# Altium schematic sheet BS5T2MBoard.SchDoc
size A
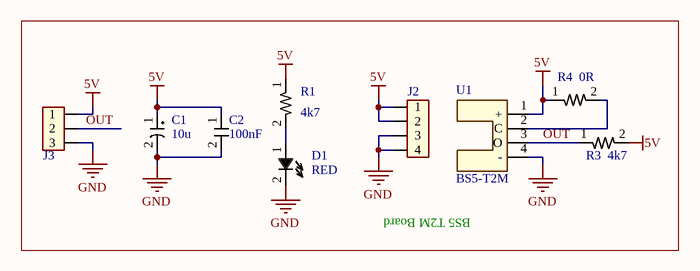
[diagram p0: BS5T2MBoard.SchDoc]

## Parts
C1  value 10u  [Tantalum Size A]  (hidden comment: Cap Pol)
C2  value 100nF  [C0805]  (hidden comment: Cap Non Pol)
D1  value RED  [D0805]  (hidden comment: LED)
J2  Header 1x4  [Header 1x4 Oval]  (value not drawn)
J3  Header 1x3  [Header 1x3 Oval]  (value not drawn)
R1  value 4k7  [R0805]  (hidden comment: Resistor)
R3  value 4k7  [R0805]  (hidden comment: Resistor)
R4  value 0R  [R0805]  (hidden comment: Resistor)
U1  BS5-T2M  [BS5-T2M]

## Blocks framed on the sheet
BS5 T2M Board: C1 C2 D1 J2 J3 R1 R3 R4 U1

## Nets
5V: C1.1 C2.1 J2.1 J2.2 J3.1 R1.1 R3.2 R4.1 U1.1(+)
GND: C1.2 C2.2 D1.2 J2.3 J2.4 J3.3 U1.4(-)
OUT: J3.2 R3.1 U1.3(O)
NetD1_1: D1.1 R1.2
NetR4_2: R4.2 U1.2(C)

## Library data of the parts
C1 = Cap Pol: Polarised Capacitor; Link: *
C2 = Cap Non Pol: Non Polarised Capacitor; Link: *
J2 = Header 1x4: 2.54mm Single Male/Female Pin Header; Link: *
J3 = Header 1x3: 2.54mm Single Male/Female Pin Header; Link: *
U1 = BS5-T2M: Opto Interrupter, Sensing Distance 5mm; Link: *
D1 = LED: Link: *
R1 R3 R4 = Resistor: Link: *